# Altium schematic sheet 电源.SchDoc
size A4
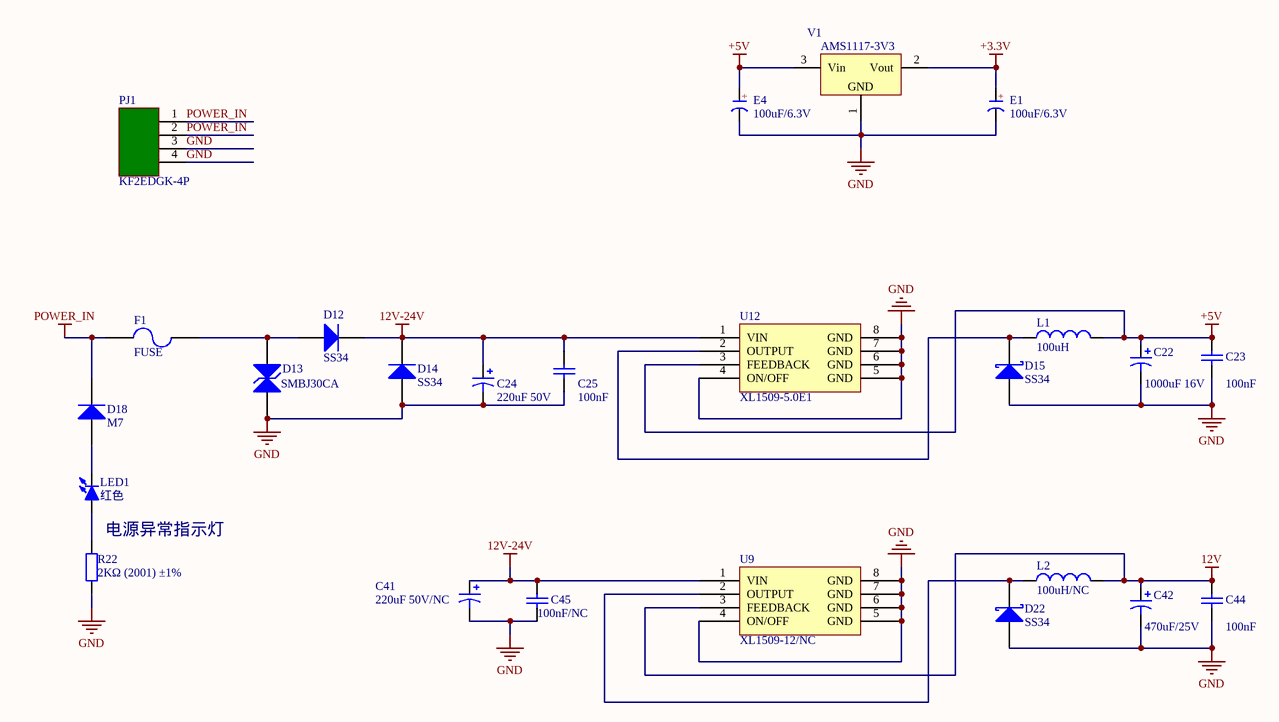
[diagram p0: 电源.SchDoc]

## Parts
C22  value 1000uF 16V  [CAP 5.0*10*12.5]  (hidden comment: Cap Pol1)
C23  value 100nF  [1206_c]  (hidden comment: Cap Semi)
C24  value 220uF 50V  [CAP 5.0*10*12.5]  (hidden comment: Cap Pol1)
C25  100nF  [1206_c]
C41  value 220uF 50V/NC  [CAP 5.0*10*12.5]  (hidden comment: Cap Pol1)
C42  value 470uF/25V  [CAP 5.0*10*12.5]  (hidden comment: Cap Pol1)
C44  value 100nF  [1206_c]  (hidden comment: Cap Semi)
C45  100nF/NC  [1206_c]
D12  SS34  [SMA(DO-214AC)_S1]
D13  SMBJ30CA  [SMB(DO-214AA)_S1]
D14  SS34  [SMA(DO-214AC)_S1]
D15  SS34  [SMA(DO-214AC)_S1]
D18  M7  [SMA(DO-214AC)_S1]
D22  SS34  [SMA(DO-214AC)_S1]
E1  100uF/6.3V  [CM C(5*5.4)]
E4  100uF/6.3V  [CM C(5*5.4)]
F1  FUSE  [FUSE-RAD0.2]
L1  value 100uH  [CD75]  (hidden comment: Inductor)
L2  value 100uH/NC  [CD75]  (hidden comment: Inductor)
LED1  红色  [LED 1206R]
PJ1  KF2EDGK-4P  [KF2EDGK5.08W-4P]
R22  2KΩ (2001) ±1%  [1206_R]
U9  XL1509-12/NC  [SOP-8_150mil]
U12  XL1509-5.0E1  [SOP-8_150mil]
V1  AMS1117-3V3  [SOT223_L]

## Nets
12V: C42.1 C44.2 L2.2 U9.3(FEEDBACK)
12V-24V: C24.1 C25.2 C41.1 C45.2 D12.2(K) D14.2(K) U9.1(VIN) U12.1(VIN)
+3.3V: E1.1(A) V1.2(Vout)
+5V: C22.1 C23.2 E4.1(A) L1.2 U12.3(FEEDBACK) V1.3(Vin)
GND: C22.2 C23.1 C24.2 C25.1 C41.2 C42.2 C44.1 C45.1 D13.1(A) D14.1(A) D15.1(A) D22.1(A) E1.2(K) E4.2(K) PJ1.3 PJ1.4 R22.1 U9.4(ON/OFF) U9.5(GND) U9.6(GND) U9.7(GND) U9.8(GND) U12.4(ON/OFF) U12.5(GND) U12.6(GND) U12.7(GND) U12.8(GND) V1.1(GND)
POWER_IN: D18.2(K) F1.1 PJ1.1 PJ1.2
NetD12_1: D12.1(A) D13.2(K) F1.2
NetD15_2: D15.2(K) L1.1 U12.2(OUTPUT)
NetD18_1: D18.1(A) LED1.2(K)
NetD22_2: D22.2(K) L2.1 U9.2(OUTPUT)
NetLED1_1: LED1.1(A) R22.2

## Notes on the sheet
- 电源异常指示灯
- (in symbol C-CM) +

## Library data of the parts
C22 C24 C41 C42 = Cap Pol1: Polarized Capacitor (Radial); Published: 8-Jun-2000; LatestRevisionDate: 17-Jul-2002; LatestRevisionNote: Re-released for DXP Platform.; PackageReference: RB7.6-15; Publisher: Altium Limited
  C24 C41: PackageDescription: Polarized Capacitor (Radial); 2 Leads
C23 C44 = Cap Semi: Capacitor (Semiconductor SIM Model); Published: 8-Jun-2000; LatestRevisionDate: 29-May-2009; LatestRevisionNote: IPC-7351 Footprint Added.; PackageReference: C1206; Publisher: Altium Limited; PackageDescription: Chip Capacitor
C25 C45 = 0603 100nF (104) 10% 50V: 贴片电容; ComponentLink1Description: 供应商链接; ComponentLink1URL: http://www.szlcsc.com/product/details_15331.html; Package: 0603; Supplier: LC; SuppliersPartNumber: C14663
D12 D14 = SMA(DO-214AC) SS54: 二极管; ComponentLink1Description: 供应商链接; ComponentLink1URL: http://www.szlcsc.com/product/details_23178.html; Package: SMA(DO-214AC); Supplier: LC; SuppliersPartNumber: C22452
D13 = SMB/DO-214AA P6SMB6.8CA: TVS; ComponentLink1Description: 供应商链接; ComponentLink1URL: http://www.szlcsc.com/product/details_79530.html; Package: SMB/DO-214AA; Supplier: LC; SuppliersPartNumber: C78395
D15 D22 = D Schottky: Schottky Diode; Published: 8-Jun-2000; LatestRevisionDate: 17-Jul-2002; LatestRevisionNote: Re-released for DXP Platform.; PackageReference: SMB; Publisher: Altium Limited; Code_JEDEC: DO-214-AA
D18 = SMA(DO-214AC) M7: 二极管; 备注: 1N4007 4007 编号C2464 已经停售, 使用新物料编号C95872; ComponentLink1Description: 供应商链接; ComponentLink1URL: http://www.szlcsc.com/product/details_2841.html; Package: SMA(DO-214AC); Supplier: LC; SuppliersPartNumber: C95872
E1 E4 = C-CM: 贴片电解电容; 版权归属: 源创客; BOM名称: 贴片电解电容; 学习资源: www.ooocke.com
L1 L2 = Inductor: Code_IEC: 1005; Published: 8-Jun-2000; LatestRevisionDate: 29-May-2009; LatestRevisionNote: IPC-7351 Footprint Added.; PackageReference: 0402-A; Publisher: Altium Limited; PackageDescription: Chip Inductor; Code_JEITA: 0402
LED1 = LED-SMD: 贴片LED; 版权归属: 源创客; BOM名称: 贴片LED; 学习资源: www.ooocke.com
R22 = 1206 2KΩ (2001) 1%: 贴片电阻; ComponentLink1Description: 供应商链接; ComponentLink1URL: http://www.szlcsc.com/product/details_18632.html; Package: 1206; Supplier: LC; SuppliersPartNumber: C17944
U9 U12 = XL1509-5.0E1: DC-DC芯片; ComponentLink1Description: 供应商链接; ComponentLink1URL: http://www.szlcsc.com/product/details_62115.html; Package: SOP-8_150mil; Supplier: LC; SuppliersPartNumber: C61063
V1 = AMS1117: 三端稳压芯片; BOM名称: 稳压芯片; 版权归属: 源创客; 学习资源: www.ooocke.com